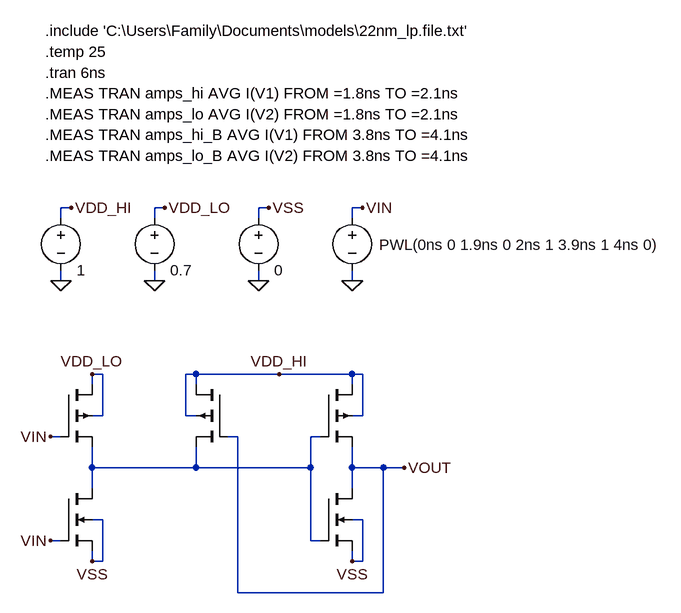
[diagram p0: schematic Q2.asc]
Q2.asc, the LTspice schematic file:
Version 4
SHEET 1 1132 680
WIRE -32 -16 -48 -16
WIRE 112 -16 96 -16
WIRE 272 -16 256 -16
WIRE 416 -16 400 -16
WIRE -48 0 -48 -16
WIRE 96 0 96 -16
WIRE 256 0 256 -16
WIRE 400 0 400 -16
WIRE -48 96 -48 80
WIRE 96 96 96 80
WIRE 256 96 256 80
WIRE 400 96 400 80
WIRE 16 240 0 240
WIRE 160 240 144 240
WIRE 288 240 160 240
WIRE 400 240 288 240
WIRE 416 240 400 240
WIRE 0 256 0 240
WIRE 160 256 160 240
WIRE 400 256 400 240
WIRE 16 304 16 240
WIRE 16 304 0 304
WIRE 144 304 144 240
WIRE 160 304 144 304
WIRE 416 304 416 240
WIRE 416 304 400 304
WIRE -48 336 -64 336
WIRE 224 336 208 336
WIRE 352 336 336 336
WIRE 0 384 0 352
WIRE 160 384 160 352
WIRE 160 384 0 384
WIRE 336 384 336 336
WIRE 336 384 160 384
WIRE 400 384 400 352
WIRE 448 384 400 384
WIRE 480 384 448 384
WIRE 0 416 0 384
WIRE 400 416 400 384
WIRE 16 464 0 464
WIRE 416 464 400 464
WIRE -48 496 -64 496
WIRE 336 496 336 384
WIRE 352 496 336 496
WIRE 0 528 0 512
WIRE 16 528 16 464
WIRE 16 528 0 528
WIRE 400 528 400 512
WIRE 416 528 416 464
WIRE 416 528 400 528
WIRE 224 576 224 336
WIRE 448 576 448 384
WIRE 448 576 224 576
FLAG -48 96 0
FLAG 96 96 0
FLAG 400 96 0
FLAG 256 96 0
FLAG -32 -16 VDD_HI
FLAG 112 -16 VDD_LO
FLAG 416 -16 VIN
FLAG 272 -16 VSS
FLAG 0 528 VSS
FLAG -64 336 VIN
FLAG -64 496 VIN
FLAG 0 240 VDD_LO
FLAG 400 528 VSS
FLAG 480 384 VOUT
FLAG 288 240 VDD_HI
SYMBOL pmos4 -48 256 R0
WINDOW 0 56 32 Invisible 2
WINDOW 3 56 72 Invisible 2
SYMATTR InstName M1
SYMATTR Value2 l=0.03u w=1.4u
SYMBOL nmos4 -48 416 R0
WINDOW 0 56 32 Invisible 2
WINDOW 3 56 72 Invisible 2
SYMATTR InstName M2
SYMATTR Value2 l=0.03u w=0.8u
SYMBOL voltage -48 -16 R0
WINDOW 0 24 16 Invisible 2
SYMATTR InstName V1
SYMATTR Value 1
SYMBOL voltage 96 -16 R0
WINDOW 0 24 16 Invisible 2
SYMATTR InstName V2
SYMATTR Value 0.7
SYMBOL voltage 400 -16 R0
WINDOW 0 24 16 Invisible 2
WINDOW 3 42 57 Left 2
WINDOW 123 0 0 Left 2
WINDOW 39 0 0 Left 2
SYMATTR InstName V3
SYMATTR Value PWL(0ns 0 1.9ns 0 2ns 1 3.9ns 1 4ns 0)
SYMBOL voltage 256 -16 R0
WINDOW 0 24 16 Invisible 2
SYMATTR InstName V4
SYMATTR Value 0
SYMBOL pmos4 352 256 R0
WINDOW 0 56 32 Invisible 2
WINDOW 3 56 72 Invisible 2
SYMATTR InstName M3
SYMATTR Value2 l=0.03u w=1.4u
SYMBOL nmos4 352 416 R0
WINDOW 0 56 32 Invisible 2
WINDOW 3 56 72 Invisible 2
SYMATTR InstName M4
SYMATTR Value2 l=0.03u w=0.8u
SYMBOL pmos4 208 256 M0
WINDOW 0 56 32 Invisible 2
WINDOW 3 56 72 Invisible 2
SYMATTR InstName M5
SYMATTR Value2 l=0.03u w=0.12u
TEXT -72 -288 Left 2 !.include 'C:\\Users\\Family\\Documents\\models\\22nm_lp.file.txt'
TEXT -72 -256 Left 2 !.temp 25
TEXT -72 -224 Left 2 !.tran 6ns
TEXT -72 -192 Left 2 !.MEAS TRAN amps_hi AVG I(V1) FROM =1.8ns TO =2.1ns
TEXT -72 -96 Left 2 !.MEAS TRAN amps_lo_B AVG I(V2) FROM 3.8ns TO =4.1ns
TEXT -72 -160 Left 2 !.MEAS TRAN amps_lo AVG I(V2) FROM =1.8ns TO =2.1ns
TEXT -72 -128 Left 2 !.MEAS TRAN amps_hi_B AVG I(V1) FROM 3.8ns TO =4.1ns

The netlist it stands for:
* Q2.asc
M1 VDD_LO VIN N001 VDD_LO PMOS l=0.03u w=1.4u
M2 N001 VIN VSS VSS NMOS l=0.03u w=0.8u
V1 VDD_HI 0 1
V2 VDD_LO 0 0.7
V3 VIN 0 PWL(0ns 0 1.9ns 0 2ns 1 3.9ns 1 4ns 0)
V4 VSS 0 0
M3 VDD_HI N001 VOUT VDD_HI PMOS l=0.03u w=1.4u
M4 VOUT N001 VSS VSS NMOS l=0.03u w=0.8u
M5 VDD_HI VOUT N001 VDD_HI PMOS l=0.03u w=0.12u
.model NMOS NMOS
.model PMOS PMOS
.lib standard.mos
.include 'C:\Users\Family\Documents\models\22nm_lp.file.txt'
.temp 25
.tran 6ns
.MEAS TRAN amps_hi AVG I(V1) FROM =1.8ns TO =2.1ns
.MEAS TRAN amps_lo_B AVG I(V2) FROM 3.8ns TO =4.1ns
.MEAS TRAN amps_lo AVG I(V2) FROM =1.8ns TO =2.1ns
.MEAS TRAN amps_hi_B AVG I(V1) FROM 3.8ns TO =4.1ns
.backanno
.end